# Altium project UZ_A_DAC.PrjPcb (part 2 of 3)

## Sheet Power_Neg.SchDoc
size A4; DocumentNumber: 3; SheetNumber: 3; SheetTotal: 11
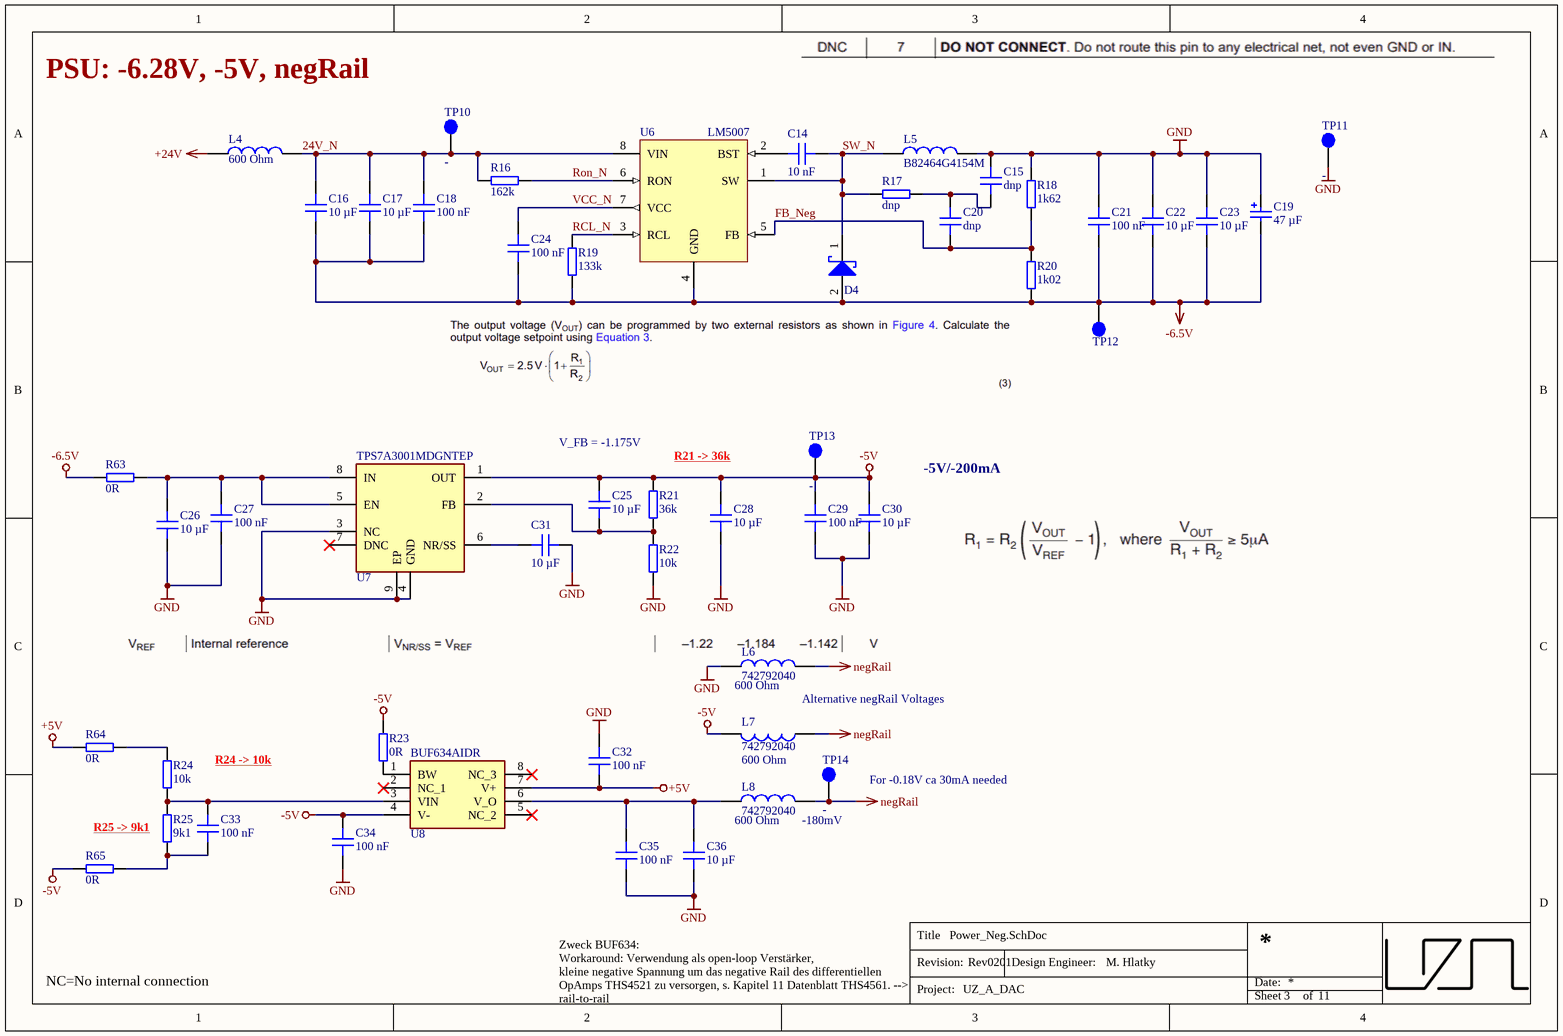
[diagram p4: Power_Neg.SchDoc]

### Parts
C14  10 nF  [C_0603]
C15  dnp  [C_1206]
C16  10 µF  [C_1206]
C17  10 µF  [C_1206]
C18  100 nF  [C_0603]
C19  47 µF  [WCAP-ASLI_5x5.5]
C20  dnp  [C_1206]
C21  100 nF  [C_0603]
C22  10 µF  [C_1206]
C23  10 µF  [C_1206]
C24  100 nF  [C_0603]
C25  10 µF  [C_1206]
C26  10 µF  [C_1206]
C27  100 nF  [C_0603]
C28  10 µF  [C_1206]
C29  100 nF  [C_0603]
C30  10 µF  [C_1206]
C31  10 µF  [C_1206]
C32  100 nF  [C_0603]
C33  100 nF  [C_0603]
C34  100 nF  [C_0603]
C35  100 nF  [C_0603]
C36  10 µF  [C_1206]
D4  BYS12-90-E3/TR3  [DIOM4227X23N]  (value not drawn)
L4  value 600 Ohm  [WE-CBF_0805_High Current]  (hidden comment: 742792040)
L5  B82464G4154M  [SMT_inductor_1050]
L6  742792040  value 600 Ohm  [WE-CBF_0805_High Current]
L7  742792040  value 600 Ohm  [WE-CBF_0805_High Current]
L8  742792040  value 600 Ohm  [WE-CBF_0805_High Current]
R16  162k  [RES 0603_1608]
R17  dnp  [RES 0603_1608]
R18  1k62  [RES 0603_1608]
R19  133k  [RES 0603_1608]
R20  1k02  [RES 0603_1608]
R21  36k  [RES 0603_1608]
R22  10k  [RES 0603_1608]
R23  0R  [RES 0603_1608]
R24  10k  [RES 0603_1608]
R25  9k1  [RES 0603_1608]
R63  0R  [RES 0603_1608]
R64  0R  [RES 0603_1608]
R65  0R  [RES 0603_1608]
TP10  -  [TP_1mm]
TP11  -  [TP_1mm]
TP12  -  [TP_1mm]  (value not drawn)
TP13  -  [TP_1mm]
TP14  -  [TP_1mm]
U6  LM5007MM/NOPB  [TSOP65P490X110-8N]  (value not drawn)
U7  TPS7A3001MDGNTEP  [SOP65P490X110-9N]
U8  BUF634AIDR  [SOIC127P600X175-8N]

### Nets
+5V: C32.1 R64.1 U8.7(V+)
+24V: L4.1
-5V: C25.2 C28.2 C29.2 C30.2 C34.2 L7.2 R21.2 R23.2 R65.1 TP13.1 U7.1(OUT) U8.4(V-)
-6.5V: C16.1 C17.1 C18.1 C19.2(N) C21.1 C22.1 C23.1 C24.1 D4.2(A) R19.1 R20.1 R63.1 TP12.1 U6.4(GND)
GND: C15.2 C19.1(P) C21.2 C22.2 C23.2 C26.1 C27.1 C28.1 C29.1 C30.1 C31.1 C32.2 C34.1 C35.1 C36.1 L5.2 L6.1 R18.2 R22.1 TP11.1 U7.3(NC) U7.4(GND) U7.9(EP)
negRail: L6.2 L7.1 L8.2 TP14.1
24V_N: C16.2 C17.2 C18.2 L4.2 R16.1 TP10.1 U6.8(VIN)
FB_Neg: C20.1 R18.1 R20.2 U6.5(FB)
RCL_N: R19.2 U6.3(RCL)
Ron_N: R16.2 U6.6(RON)
SW_N: C14.2 D4.1(K) L5.1 R17.1 U6.1(SW)
VCC_N: C24.2 U6.7(VCC)
NetC14_1: C14.1 U6.2(BST)
NetC15_1: C15.1 C20.2 R17.2
NetC25_1: C25.1 R21.1 R22.2 U7.2(FB)
NetC26_2: C26.2 C27.2 R63.2 U7.5(EN) U7.8(IN)
NetC31_2: C31.2 U7.6(NR/SS)
NetC33_1: C33.1 R25.1 R65.2
NetC33_2: C33.2 R24.1 R25.2 U8.3(VIN)
NetC35_2: C35.2 C36.2 L8.1 U8.6(V_O)
NetR23_1: R23.1 U8.1(BW)
NetR24_2: R24.2 R64.2

Not connected (* = marked no-connect by the designer): U7 7(DNC)*; U8 2(NC_1)* 5(NC_2)* 8(NC_3)*

### Notes on the sheet
- PSU: -6.28V, -5V, negRail
- V_FB = -1.175V
- R21 -> 36k
- -5V/-200mA
- Alternative negRail Voltages
- R24 -> 10k
- (near TP14) For -0.18V ca 30mA needed
- (near R25) R25 -> 9k1
- (near L8) -180mV
- NC=No internal connection
- Zweck BUF634:
  Workaround: Verwendung als open-loop Verstärker,
  kleine negative Spannung um das negative Rail des differentiellen OpAmps THS4521 zu versorgen, s. Kapitel 11 Datenblatt THS4561. --> rail-to-rail
- Title
- Revision:
- Design Engineer:
- Date:
- Project:
- Sheet
- of

### Library data of the parts
C14 = 885012206065: Capacitor 0603, 25 VDC, 10 nF, X7R; Manufacturer: Wurth Elektronik; Tolerance: 10 %; Voltage Rating: 25 VDC; Created from: MGremer; Manufacturer Part Number: 885012206065; PartID: 53; Created On: 20.12.2020 13:54:13; ComponentLink1Description: Datasheet; ComponentLink1URL: https://www.mouser.de/datasheet/2/445/885012206065-1727544.pdf; Component Type: Capacitor 0603; Device Package: 0603; Last Updated: 20.12.2020 16:43:29; Mounting Type: SMD; Operating Temperature: -55 - 125°C; Series: WCAP-CSGP; Supplier 1: Mouser; Supplier Part Number 1: 710-885012206065; Type: Capacitor; Value: 10 nF; Live Cycle Status: 1; Stock number: not stored
C15 C20 = GRM3195C1H273JA01D: Capacitor 1206, 50 VDC, 0.027 µF, C0G; Manufacturer: Murata Electronics; Tolerance: 5 %; Voltage Rating: 50 VDC; Created from: MGremer; Manufacturer Part Number: GRM3195C1H273JA01D; PartID: 51; Created On: 20.12.2020 13:54:13; ComponentLink1Description: Datasheet; ComponentLink1URL: https://www.mouser.de/datasheet/2/281/murata_03052018_GRM_Series_1-1310166.pdf; Component Type: Capacitor 1206; Device Package: 1206; Last Updated: 18.01.2021 14:28:15; Mounting Type: SMD; Operating Temperature: -55 - 125°C; Series: GRM; Supplier 1: Mouser; Supplier Part Number 1: 81-GRM315C1H273JA01D; Type: Capacitor; Value: 0.027 µF; Live Cycle Status: 1; Stock number: not stored
C16 C17 C22 C23 C25 C26 C28 C30 C31 C36 = GRT31CR61H106KE01L: Capacitor 1206, 50 VDC, 10 µF, X5R; Manufacturer: Murata Electronics; Tolerance: 10 %; Voltage Rating: 50 VDC; Created from: MGremer; Manufacturer Part Number: GRT31CR61H106KE01L; PartID: 65; Created On: 20.12.2020 13:54:13; ComponentLink1Description: Datasheet; ComponentLink1URL: https://www.mouser.de/datasheet/2/281/1/GRT31CR61H106KE01_01-1989724.pdf; Component Type: Capacitor 1206; Device Package: 1206; Last Updated: 20.12.2020 16:34:30; Mounting Type: SMD; Operating Temperature: -55 - 85°C; Series: GRT; Supplier 1: Mouser; Supplier Part Number 1: 81-GRT31CR61H106KE1L; Type: Capacitor; Value: 10 µF; Live Cycle Status: 1; Stock number: Labor SMD Container
C18 C21 C24 C27 C29 C32-C35 = C0603C104K9PACTU: Capacitor 0603, 6.3 VDC, 100 nF, X5R; Manufacturer: KEMET; Tolerance: 10 %; Voltage Rating: 6.3 VDC; Created from: MGremer; Manufacturer Part Number: C0603C104K9PACTU; PartID: 70; Created On: 20.12.2020 13:54:13; ComponentLink1Description: Datasheet; ComponentLink1URL: https://www.mouser.de/datasheet/2/212/KEM_C1006_X5R_SMD-1103249.pdf; Component Type: Capacitor 0603; Device Package: 0603; Last Updated: 20.01.2021 13:57:36; Mounting Type: SMD; Operating Temperature: -55 - 85°C; Series: SMD Comm X5R; Supplier 1: Mouser; Supplier Part Number 1: 80-C0603C104K9P; Type: Capacitor; Value: 100 nF; Live Cycle Status: 1; Stock number: not stored
C19 = 865080242004: Capacitor WCAP, 6.3 VDC, 100 µF; Manufacturer: Wuerth Elektronik; Tolerance: 20 %; Voltage Rating: 10 VDC; Created from: MHlatky; Manufacturer Part Number: 865080242004; PartID: 90; Created On: 20.12.2020 13:54:13; ComponentLink1Description: Datasheet; ComponentLink1URL: https://www.mouser.de/datasheet/2/445/865080242004-1726409.pdf; Component Type: Capacitor WCAP; Device Package: WCAP; Last Updated: 18.01.2021 16:16:48; Mounting Type: SMD; Operating Temperature: -55 - 105°C; Series: WCAP-ASLI; Supplier 1: Mouser; Supplier Part Number 1: 710-865080242004; Type: Capacitor; Value: 47 µF; Live Cycle Status: 1; Stock number: not stored
D4 = BYS12-90-E3/TR3: Schottky Rectifier, 1.5 A, 90 V; Manufacturer: Vishay General Semiconductor; Forward Voltage: 0.75 V; Forward Current: 1.5 A; Reverse Current: 100 µA; Created from: MGremer; Supplier 1: Mouser; Supplier Part Number 1: 625-BYS12-90-E3/TR3; Manufacturer Part Number: BYS12-90-E3/TR3; PartID: 2; Created On: 06.01.2021 14:34:10; ComponentLink1Description: Datasheet; ComponentLink1URL: https://www.mouser.de/datasheet/2/427/bys12_90-1768074.pdf; Component Type: Schottky Rectifier; Device Package: SMA; Last Updated: 18.01.2021 16:09:20; Mounting Type: SMD; Operating Temperature: -55 - 150 °C; Type: Schottky Rectifier; Value: -; Live Cycle Status: 1; Stock number: not stored
L4 L6-L8 = 742792040: Inductance, 0805, 100 MHz, 600 Ohm, 2 A; Manufacturer: Wurth Elektronik; Type: Inductance SMD; DC current: 2 A; Created from: MGremer; Manufacturer Part Number: 742792040; PartID: 1; Created On: 18.01.2021 14:53:17; ComponentLink1Description: Datasheet; ComponentLink1URL: https://www.mouser.de/datasheet/2/445/742792040-1720361.pdf; Component Type: Inductance; Device Package: 0805; Last Updated: 18.01.2021 14:53:25; Mounting Type: SMD; Operating Temperature: -55 - 125 °C; Series: WE-CBF; Supplier 1: Mouser; Supplier Part Number 1: 710-742792040; Live Cycle Status: 1; Stock number: not stored
L5 = B82464G4154M: Inductor SMT, 10 x 10, 150 µH, 0.8 A; Manufacturer: TDK; MF: EPCOS / TDK; Value: 150 µH; DCR: 320m; Rated Current: 0.85 A; DC current: 0.8 A; Created from: MGremer; MPN: B82464G4154M; Supplier 1: Mouser; Supplier Part Number 1: 871-B82464G4154M; Manufacturer Part Number: B82464G4154M; PartID: 5; Created On: 08.06.2021 11:33:39; ComponentLink1Description: Datasheet; ComponentLink1URL: https://www.tdk-electronics.tdk.com/inf/30/db/ind_2008/b82464g4.pdf; Component Type: Inductor; Device Package: 10.4 x 10.4 x 4.8 (mm); Last Updated: 24.08.2021 15:23:28; Mounting Type: SMD; Operating Temperature: -55 - 125 °C; Series: B82464G; Type: Inductor; Live Cycle Status: 1; Stock number: not stored
R16 = CR0603-FX-1623ELF: SMD resistor 1%; Manufacturer: Burns; Created from: MGremer; Manufacturer Part Number: CR0603-FX-1623ELF; PartID: 165; Created On: 14.12.2020 16:17:14; ComponentLink1Description: Datasheet; ComponentLink1URL: https://www.mouser.de/datasheet/2/54/crxxxxx-1858361.pdf; Component Type: SMD resistor; Device Package: 0603; Last Updated: 02.03.2021 14:07:32; Mounting Type: SMD; Supplier 1: Mouser; Supplier Part Number 1: 652-CR0603-FX1623ELF; Type: Resistor; Tolerance: 1%; Value: 162k; Live Cycle Status: 1; Stock number: not stored
R17 = -: SMD resistor E24 series; Created from: MGremer; Manufacturer Part Number: -; PartID: 147; Created On: 14.12.2020 16:17:14; ComponentLink1Description: Datasheet; ComponentLink1URL: -; Component Type: SMD resistor; Device Package: 0603; Last Updated: 02.03.2021 14:07:32; Manufacturer: -; Mounting Type: SMD; Supplier 1: -; Supplier Part Number 1: -; Type: Resistor; Tolerance: -; Value: dnp; Live Cycle Status: 1; Stock number: Labor SMD Container
R18 = ERJ-P03F1621V: SMD resistor 1%; Manufacturer: Panasonic; Created from: MGremer; Manufacturer Part Number: ERJ-P03F1621V; PartID: 191; Created On: 14.12.2020 16:17:14; ComponentLink1Description: Datasheet; ComponentLink1URL: https://www.mouser.de/datasheet/2/315/AOA0000C331-1141874.pdf; Component Type: SMD resistor; Device Package: 0603; Last Updated: 02.07.2021 11:49:34; Mounting Type: SMD; Supplier 1: Mouser; Supplier Part Number 1: 667-ERJ-P03F1621V; Type: Resistor; Tolerance: 1%; Value: 1k62; Live Cycle Status: 1; Stock number: not stored
R19 = CR0603-FX-1333ELF: SMD resistor 1%; Manufacturer: Burns; Created from: MGremer; Manufacturer Part Number: CR0603-FX-1333ELF; PartID: 166; Created On: 14.12.2020 16:17:14; ComponentLink1Description: Datasheet; ComponentLink1URL: https://www.mouser.de/datasheet/2/54/crxxxxx-1858361.pdf; Component Type: SMD resistor; Device Package: 0603; Last Updated: 02.03.2021 14:07:32; Mounting Type: SMD; Supplier 1: Mouser; Supplier Part Number 1: 652-CR0603FX-1333ELF; Type: Resistor; Tolerance: 1%; Value: 133k; Live Cycle Status: 1; Stock number: not stored
R20 = CR0603-FX-1021ELF: SMD resistor 1%; Manufacturer: Burns; Created from: MGremer; Manufacturer Part Number: CR0603-FX-1021ELF; PartID: 168; Created On: 14.12.2020 16:17:14; ComponentLink1Description: Datasheet; ComponentLink1URL: https://www.mouser.de/datasheet/2/54/crxxxxx-1858361.pdf; Component Type: SMD resistor; Device Package: 0603; Last Updated: 02.03.2021 14:07:32; Mounting Type: SMD; Supplier 1: Mouser; Supplier Part Number 1: 652-CR0603FX-1021ELF; Type: Resistor; Tolerance: 1%; Value: 1k02; Live Cycle Status: 1; Stock number: not stored
R21 = RK73H1ETTP3602F: SMD resistor 1%; Manufacturer: KOA Speer; Created from: MHoerner; Manufacturer Part Number: RK73H1ETTP3602F; PartID: 302; Created On: 07.11.2023 16:01:42; ComponentLink1Description: Datasheet; ComponentLink1URL: https://www.koaspeer.com/pdfs/RK73H.pdf; Component Type: SMD resistor; Device Package: 0603; Last Updated: 07.11.2023 16:03:21; Mounting Type: SMD; Supplier 1: Mouser; Supplier Part Number 1: 660-RK73H1ETTP3602F; Type: Resistor; Tolerance: 1%; Value: 36k; Live Cycle Status: 1; Stock number: not stored; LCSC Part Number: C114619
R22 R24 = RK73B1JTTD103J: SMD resistor E24 series; Manufacturer: KOA Speer; Tolerance: 5%; Created from: MGremer; Manufacturer Part Number: RK73B1JTTD103J; PartID: 98; Created On: 14.12.2020 16:17:14; ComponentLink1Description: Datasheet; ComponentLink1URL: https://www.mouser.de/datasheet/2/219/RK73B-1825463.pdf; Component Type: SMD resistor; Device Package: 0603; Mounting Type: SMD; Supplier 1: Mouser; Supplier Part Number 1: 660-RK73B1JTTD103J; Type: Resistor; Value: 10k; Live Cycle Status: 1; Stock number: Labor SMD Container
  R22: Last Updated: 02.03.2021 14:07:32
  R24: Last Updated: 27.05.2022 14:04:22; LCSC Part Number: C25804
R23 R63-R65 = RC0603JR-070RL: SMD resistor E24 series; Manufacturer: YAGEO; Tolerance: 5%; Created from: MGremer; Manufacturer Part Number: RC0603JR-070RL; PartID: 1; Created On: 14.12.2020 16:17:14; ComponentLink1Description: Datasheet; ComponentLink1URL: https://www.mouser.de/datasheet/2/447/PYu-RC_Group_51_RoHS_L_10-1664068.pdf; Component Type: SMD resistor; Device Package: 0603; Last Updated: 04.03.2021 09:09:42; Mounting Type: SMD; Supplier 1: Mouser; Supplier Part Number 1: 603-RC0603JR-070RL; Supplier 2: LCSC; Supplier Part Number 2: C21189; Type: Resistor; Value: 0R; Live Cycle Status: 1; Stock number: Labor SMD Container; LCSC Part Number: C21189
R25 = SG73S1JTTD9101F: SMD resistor 1%; Manufacturer: KOA Speer; Created from: MHoerner; Manufacturer Part Number: SG73S1JTTD9101F; PartID: 301; Created On: 07.11.2023 16:01:42; ComponentLink1Description: Datasheet; ComponentLink1URL: https://www.koaspeer.com/pdfs/SG73S.pdf; Component Type: SMD resistor; Device Package: 0603; Last Updated: 07.11.2023 16:06:58; Mounting Type: SMD; Supplier 1: Mouser; Supplier Part Number 1: 660-SG73S1JTTD9101F; Type: Resistor; Tolerance: 1%; Value: 9k1; Live Cycle Status: 1; Stock number: not stored; LCSC Part Number: C23260
TP10-TP14 = -: Test Point 1 mm; Value: TP; Created from: MGremer; Created: 2018_06_25_AGeiger; Manufacturer Part Number: -; PartID: 9; Created On: 02.03.2021 14:59:37; ComponentLink1Description: Datasheet; ComponentLink1URL: -; ComponentLink2Description: Homepage; ComponentLink2URL: -; Component Type: Test Point; Device Package: SMD; Last Updated: 03.11.2021 09:04:23; Manufacturer: -; Minimum Order: 1; Mounting Type: SMD; Supplier 1: -; Supplier Part Number 1: -; Type: Test point; Live Cycle Status: 1; Stock number: not stored
U6 = LM5007MM/NOPB: LM5007 75-V, 0.5-A DC/DC Buck Converter With 80-V Integrated Power MOSFET; Manufacturer: TI; MF: Texas Instruments; Created from: MHlatky; MPN: LM5007MM/NOPB; Supplier 1: Mouser; Supplier 2: Mouser; Supplier 3: Digi-Key; Supplier Part Number 1: 926-LM5007MM/NOPB; Supplier Part Number 2: 926-LM5007MM/NOPB; Supplier Part Number 3: LM5007MM/NOPBCT-ND; Package: VSSOP-8; Manufacturer Part Number: LM5007MM/NOPB; PartID: 14; Created On: 03.03.2022 16:53:36; ComponentLink1Description: Datasheet; ComponentLink1URL: https://www.ti.com/lit/ds/symlink/lm5007.pdf?ts=1616234834930&ref_url=https%253A%252F%252Fwww.google.ru%252F; Component Type: LM5007; Last Updated: 08.03.2022 11:31:47; Mounting Type: TSOP; Operating Temperature: -40 - 125; Type: Buck Converter; Live Cycle Status: 1
U7 = TPS7A3001MDGNTEP: –36V, –200mA, ULTRALOW-NOISE, NEGATIVE LINEAR REGULATOR; Manufacturer_Name: Texas Instruments; Manufacturer: TI; Created from: MHlatky; Datasheet Link: http://www.ti.com/lit/gpn/tps7a3001-ep; Height: 1.1mm; Mouser2 Part Number: 595-TPS7A3001MDGNTEP; Mouser2 Price/Stock: https://www.mouser.com/Search/Refine.aspx?Keyword=595-TPS7A3001MDGNTEP; Manufacturer_Part_Number: TPS7A3001MDGNTEP; Manufacturer Part Number: TPS7A3001MDGNTEP; PartID: 11; Created On: 03.03.2022 16:53:36; ComponentLink1Description: Datasheet; ComponentLink1URL: https://www.ti.com/lit/ds/symlink/ths4521.pdf?HQS=dis-mous-null-mousermode-dsf-pf-null-wwe&ts=1646514637932&ref_url=https%253A%252F%252Fwww.mouser.de%252F; Component Type: TPS7A3001MDGNTEP; Last Updated: 08.03.2022 11:07:28; Mounting Type: SOP; Operating Temperature: -55 - 125; Supplier 1: Mouser; Supplier Part Number 1: 595-TPS7A3001MDGNTEP; Type: Negative Line Regulator; Live Cycle Status: 1
U8 = BUF634AIDR: 36-V, 210-MHz, 250-mA Output, High-Speed Buffer; Manufacturer_Name: Texas Instruments; Manufacturer: TI; Created from: MHlatky; Datasheet Link: http://www.ti.com/lit/gpn/BUF634A; Height: 1.75mm; Mouser2 Part Number: 595-BUF634AIDR; Mouser2 Price/Stock: https://www.mouser.com/Search/Refine.aspx?Keyword=595-BUF634AIDR; Manufacturer_Part_Number: BUF634AIDR; Manufacturer Part Number: BUF634AIDR; PartID: 1; Created On: 03.03.2022 16:53:36; ComponentLink1Description: Datasheet; ComponentLink1URL: https://www.ti.com/lit/ds/symlink/buf634a.pdf?HQS=dis-mous-null-mousermode-dsf-pf-null-wwe&ts=1646325847425&ref_url=https%253A%252F%252Fwww.mouser.de%252F; Component Type: BUF634A; Last Updated: 05.03.2022 21:08:20; Mounting Type: SOIC; Operating Temperature: -40 - 125; Supplier 1: Mouser; Supplier Part Number 1: 595-BUF634AIDR; Type: OpAmp; Live Cycle Status: 1

## Sheet DAC_Reference.SchDoc
size A4; DocumentNumber: 8; SheetNumber: 8; SheetTotal: 11
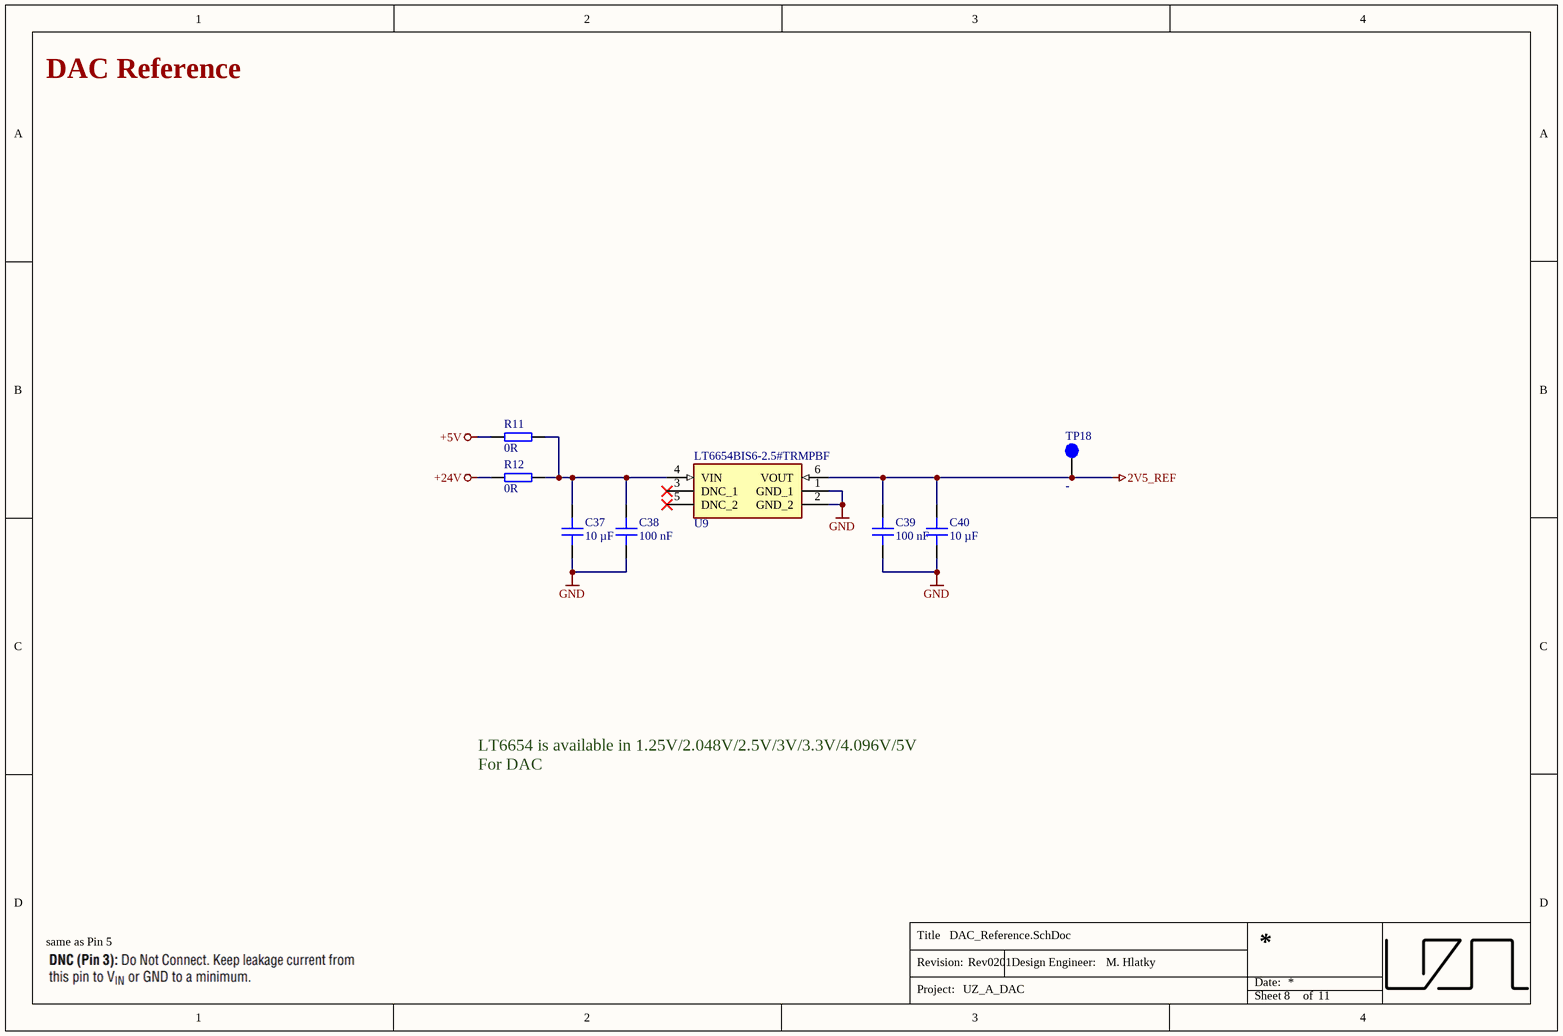
[diagram p5: DAC_Reference.SchDoc]

### Parts
C37  10 µF  [C_1206]
C38  100 nF  [C_0603]
C39  100 nF  [C_0603]
C40  10 µF  [C_1206]
R11  0R  [RES 0603_1608]
R12  0R  [RES 0603_1608]
TP18  -  [TP_1mm]
U9  LT6654BIS6-2.5#TRMPBF  [SOT95P280X100-6N]

### Nets
2V5_REF: C39.2 C40.2 TP18.1 U9.6(VOUT)
+5V: R11.1
+24V: R12.1
GND: C37.1 C38.1 C39.1 C40.1 U9.1(GND_1) U9.2(GND_2)
NetC37_2: C37.2 C38.2 R11.2 R12.2 U9.4(VIN)

Not connected (* = marked no-connect by the designer): U9 3(DNC_1)* 5(DNC_2)*

### Notes on the sheet
- DAC Reference
- LT6654 is available in 1.25V/2.048V/2.5V/3V/3.3V/4.096V/5V
  For DAC
- same as Pin 5
- Title
- Revision:
- Design Engineer:
- Date:
- Project:
- Sheet
- of

### Library data of the parts
C37 C40 = GRT31CR61H106KE01L: as C16 on sheet Power_Neg; Manufacturer Part Number: GRT31CR61H106KE01L; PartID: 65; Created On: 20.12.2020 13:54:13; ComponentLink1Description: Datasheet; ComponentLink1URL: https://www.mouser.de/datasheet/2/281/1/GRT31CR61H106KE01_01-1989724.pdf; Component Type: Capacitor 1206; Device Package: 1206; Last Updated: 20.12.2020 16:34:30; Mounting Type: SMD; Operating Temperature: -55 - 85°C; Series: GRT; Supplier 1: Mouser; Supplier Part Number 1: 81-GRT31CR61H106KE1L; Type: Capacitor; Value: 10 µF; Live Cycle Status: 1; Stock number: Labor SMD Container
C38 C39 = C0603C104K9PACTU: as C18 on sheet Power_Neg; Manufacturer Part Number: C0603C104K9PACTU; PartID: 70; Created On: 20.12.2020 13:54:13; ComponentLink1Description: Datasheet; ComponentLink1URL: https://www.mouser.de/datasheet/2/212/KEM_C1006_X5R_SMD-1103249.pdf; Component Type: Capacitor 0603; Device Package: 0603; Last Updated: 20.01.2021 13:57:36; Mounting Type: SMD; Operating Temperature: -55 - 85°C; Series: SMD Comm X5R; Supplier 1: Mouser; Supplier Part Number 1: 80-C0603C104K9P; Type: Capacitor; Value: 100 nF; Live Cycle Status: 1; Stock number: not stored
R11 R12 = RC0603JR-070RL: as R23 on sheet Power_Neg; Manufacturer Part Number: RC0603JR-070RL; PartID: 1; Created On: 14.12.2020 16:17:14; ComponentLink1Description: Datasheet; ComponentLink1URL: https://www.mouser.de/datasheet/2/447/PYu-RC_Group_51_RoHS_L_10-1664068.pdf; Component Type: SMD resistor; Device Package: 0603; Last Updated: 04.03.2021 09:09:42; Mounting Type: SMD; Supplier 1: Mouser; Supplier Part Number 1: 603-RC0603JR-070RL; Supplier 2: LCSC; Supplier Part Number 2: C21189; Type: Resistor; Value: 0R; Live Cycle Status: 1; Stock number: Labor SMD Container; LCSC Part Number: C21189
TP18 = -: as TP10 on sheet Power_Neg; Created: 2018_06_25_AGeiger; Manufacturer Part Number: -; PartID: 9; Created On: 02.03.2021 14:59:37; ComponentLink1Description: Datasheet; ComponentLink1URL: -; ComponentLink2Description: Homepage; ComponentLink2URL: -; Component Type: Test Point; Device Package: SMD; Last Updated: 03.11.2021 09:04:23; Manufacturer: -; Minimum Order: 1; Mounting Type: SMD; Supplier 1: -; Supplier Part Number 1: -; Type: Test point; Live Cycle Status: 1; Stock number: not stored
U9 = LT6654BIS6-2.5#TRMPBF: Precision Wide Supply High Output Drive Low Noise Reference; Manufacturer_Name: Analog Devices; Manufacturer_Part_Number: LT6654AHS6-5#TRMPBF; Created from: MHlatky; Datasheet Link: https://datasheet.datasheetarchive.com/originals/distributors/Datasheets_SAMA/831097393ba251ce33d430dddaea43ac.pdf; Height: 1mm; Manufacturer Part Number: LT6654BIS6-2.5#TRMPBF; PartID: 15; Created On: 03.03.2022 16:53:36; ComponentLink1Description: Datasheet; ComponentLink1URL: https://www.analog.com/media/en/technical-documentation/data-sheets/lt6654.pdf; Component Type: LT6654BIS6-2.5#TRMPBF; Last Updated: 04.04.2022 12:20:54; Manufacturer: Analog Devices; Mounting Type: SOT; Operating Temperature: -40 - 125; Supplier 1: Mouser; Supplier Part Number 1: 584-6654BIS625TRMPBF; Type: Voltage Reference; Live Cycle Status: 1

## Sheet Ethernet_Connector.SchDoc
size A4; DocumentNumber: 10; SheetNumber: 10; SheetTotal: 11
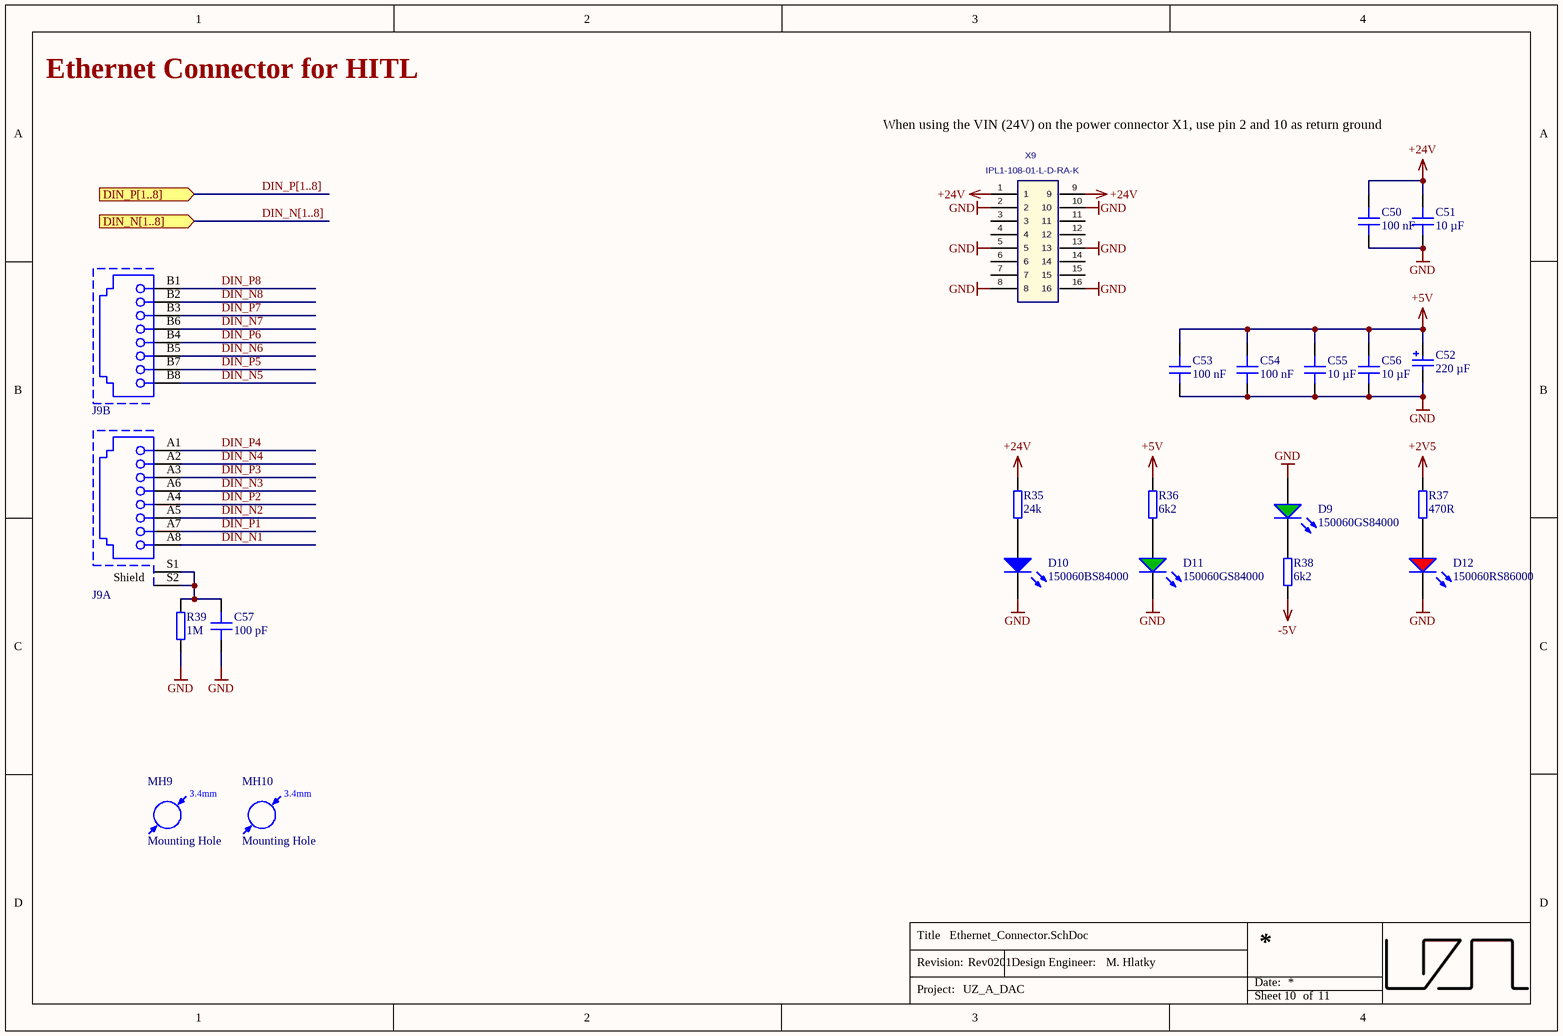
[diagram p6: Ethernet_Connector.SchDoc]

### Parts
C50  100 nF  [C_0603]
C51  10 µF  [C_1206]
C52  220 µF  [WCAP-PSHP_D8mm x L7.7mm]
C53  100 nF  [C_0603]
C54  100 nF  [C_0603]
C55  10 µF  [C_1206]
C56  10 µF  [C_1206]
C57  100 pF  [C_1206]
D9  150060GS84000  [WL-SMCW_0603]
D10  150060BS84000  [WL-SMCW_0603]
D11  150060GS84000  [WL-SMCW_0603]
D12  150060RS86000  [WL-SMCW_0603]
J9  RJHSE-5380-02  [RJHSE-5380-02]  (value not drawn)  (parts A,B of 2)
MH9  Mounting Hole  [MH_3.4]
MH10  Mounting Hole  [MH_3.4]
R35  24k  [RES 0603_1608]
R36  6k2  [RES 0603_1608]
R37  470R  [RES 0603_1608]
R38  6k2  [RES 0603_1608]
R39  1M  [RES 0603_1608]
X9  IPL1-108-01-L-D-RA-K  [IPL1-108-01-L-D-RA-K]

### Ports
DIN_N[1..8] (in), DIN_P[1..8] (in)

### Nets
+2V5: R37.2
+5V: C52.1(P) C53.2 C54.2 C55.2 C56.2 R36.2
+24V: C50.2 C51.2 R35.2 X9.1 X9.9
-5V: R38.1
GND: C50.1 C51.1 C52.2(N) C53.1 C54.1 C55.1 C56.1 C57.1 D9.2(A) D10.1(K) D11.1(K) D12.1(K) R39.1 X9.2 X9.5 X9.8 X9.10 X9.13 X9.16
DIN_N1: J9.A8
DIN_N2: J9.A5
DIN_N3: J9.A6
DIN_N4: J9.A2
DIN_N5: J9.B8
DIN_N6: J9.B5
DIN_N7: J9.B6
DIN_N8: J9.B2
DIN_P1: J9.A7
DIN_P2: J9.A4
DIN_P3: J9.A3
DIN_P4: J9.A1
DIN_P5: J9.B7
DIN_P6: J9.B4
DIN_P7: J9.B3
DIN_P8: J9.B1
NetC57_2: C57.2 J9.S1 J9.S2 R39.2
NetD9_1: D9.1(K) R38.2
NetD10_2: D10.2(A) R35.1
NetD11_2: D11.2(A) R36.1
NetD12_2: D12.2(A) R37.1

Not connected (* = marked no-connect by the designer): X9 3 4 6 7 11 12 14 15

### Buses and harness runs
bus DIN_N[1..8] = port DIN_N[1..8]
bus DIN_P[1..8] = port DIN_P[1..8]

### Notes on the sheet
- Ethernet Connector for HITL
- When using the VIN (24V) on the power connector X1, use pin 2 and 10 as return ground
- (near J9) Shield
- Title
- Revision:
- Design Engineer:
- Date:
- Project:
- Sheet
- of
- (in symbol Mounting Hole) 3.4mm

### Library data of the parts
C50 C53 C54 = C0603C104K9PACTU: as C18 on sheet Power_Neg; Manufacturer Part Number: C0603C104K9PACTU; PartID: 70; Created On: 20.12.2020 13:54:13; ComponentLink1Description: Datasheet; ComponentLink1URL: https://www.mouser.de/datasheet/2/212/KEM_C1006_X5R_SMD-1103249.pdf; Component Type: Capacitor 0603; Device Package: 0603; Last Updated: 20.01.2021 13:57:36; Mounting Type: SMD; Operating Temperature: -55 - 85°C; Series: SMD Comm X5R; Supplier 1: Mouser; Supplier Part Number 1: 80-C0603C104K9P; Type: Capacitor; Value: 100 nF; Live Cycle Status: 1; Stock number: not stored
C51 C55 C56 = GRT31CR61H106KE01L: as C16 on sheet Power_Neg; Manufacturer Part Number: GRT31CR61H106KE01L; PartID: 65; Created On: 20.12.2020 13:54:13; ComponentLink1Description: Datasheet; ComponentLink1URL: https://www.mouser.de/datasheet/2/281/1/GRT31CR61H106KE01_01-1989724.pdf; Component Type: Capacitor 1206; Device Package: 1206; Last Updated: 20.12.2020 16:34:30; Mounting Type: SMD; Operating Temperature: -55 - 85°C; Series: GRT; Supplier 1: Mouser; Supplier Part Number 1: 81-GRT31CR61H106KE1L; Type: Capacitor; Value: 10 µF; Live Cycle Status: 1; Stock number: Labor SMD Container
C52 = 875115350002: Capacitor WCAP, 16 VDC, 220 µF; Manufacturer: Wuerth Elektronik; Tolerance: 20 %; Voltage Rating: 16 VDC; Created from: MGremer; Manufacturer Part Number: 875115350002; PartID: 33; Created On: 20.12.2020 13:54:13; ComponentLink1Description: Datasheet; ComponentLink1URL: https://www.mouser.de/datasheet/2/445/875115350002-1727170.pdf; Component Type: Capacitor WCAP; Device Package: WCAP-PSHP_D8mm x L7.7mm; Last Updated: 20.12.2020 17:44:37; Mounting Type: SMD; Operating Temperature: -55 - 105°C; Series: WCAP-PSHP; Supplier 1: Mouser; Supplier Part Number 1: 710-875115350002; Type: Capacitor; Value: 220 µF; Live Cycle Status: 1; Stock number: Labor SMD Container
C57 = 885342008009: Capacitor 1206, 1 kVDC, 100 pF, C0G; Manufacturer: Wuerth Elektronik; Tolerance: 5 %; Voltage Rating: 1 kVDC; Created from: MGremer; Manufacturer Part Number: 885342008009; PartID: 62; Created On: 20.12.2020 13:54:13; ComponentLink1Description: Datasheet; ComponentLink1URL: https://www.mouser.de/datasheet/2/445/885342008009-1727900.pdf; Component Type: Capacitor 1206; Device Package: 1206; Last Updated: 20.12.2020 17:44:37; Mounting Type: SMD; Operating Temperature: -55 - 125°C; Series: WCAP-CSMH; Supplier 1: Mouser; Supplier Part Number 1: 710-885342008009; Type: Capacitor; Value: 100 pF; Live Cycle Status: 1; Stock number: Labor SMD Container
D9 D11 = 150060GS84000: WL-SMCW SMD Mono-color Chip LED Waterclear Green; Manufacturer: Wuerth Elektronik; Type: Standard; Created from: MGremer; Forward Current I_f: 20 mA; Forward Voltage U_f: 3.2 V; Wavelength: 525 nm; Light Intensity: 3000 mcd; Nominal Power: 78 mW; Manufacturer Part Number: 150060GS84000; PartID: 2; Created On: 08.12.2020 10:41:11; ComponentLink1Description: Datasheet; ComponentLink1URL: https://www.mouser.de/datasheet/2/445/150060GS75020-1714345.pdf; Component Type: LED Diode; Device Package: 0603; Last Updated: 03.03.2021 09:59:51; Mounting Type: SMD; Operating Temperature: -40 - 85 °C; Supplier 1: Mouser; Supplier Part Number 1: 710-150060GS84000; Supplier 2: Farnell; Supplier Part Number 2: 3408612; Supplier 3: Digi-Key; Supplier Part Number 3: 732-150060GS84000CT-ND; Live Cycle Status: 1; Stock number: not stored; Color: green
D10 = 150060BS84000: WL-SMCW SMD Mono-color Chip LED Waterclear Blue; Manufacturer: Wuerth Elektronik; Type: Standard; Created from: MGremer; Forward Current I_f: 20 mA; Forward Voltage U_f: 3.2 V; Wavelength: 470 nm; Light Intensity: 560 mcd; Nominal Power: 78 mW; Manufacturer Part Number: 150060BS84000; PartID: 1; Created On: 08.12.2020 10:19:38; ComponentLink1Description: Datasheet; ComponentLink1URL: https://www.mouser.de/datasheet/2/445/150060BS84000-1838909.pdf; Component Type: LED Diode; Device Package: 0603; Last Updated: 03.03.2021 09:59:51; Mounting Type: SMD; Operating Temperature: -40 - 85 °C; Supplier 1: Mouser; Supplier Part Number 1: 710-150060BS84000; Supplier 2: Farnell; Supplier Part Number 2: 3408611; Supplier 3: Digi-Key; Supplier Part Number 3: 732-150060BS84000CT-ND; Live Cycle Status: 1; Stock number: not stored; Color: blue
D12 = 150060RS86000: WL-SMCW SMD Mono-color Chip LED Waterclear Red; Manufacturer: Wuerth Elektronik; Type: Standard; Created from: MGremer; Forward Current I_f: 20 mA; Forward Voltage U_f: 2 V; Wavelength: 624 nm; Light Intensity: 800 mcd; Nominal Power: 48 mW; Manufacturer Part Number: 150060RS86000; PartID: 3; Created On: 08.12.2020 10:48:12; ComponentLink1Description: Datasheet; ComponentLink1URL: https://www.mouser.de/datasheet/2/445/150120RS75000-1714636.pdf; Component Type: LED Diode; Device Package: 0603; Last Updated: 03.03.2021 09:59:52; Mounting Type: SMD; Operating Temperature: -40 - 85 °C; Supplier 1: Mouser; Supplier Part Number 1: 710-150060RS86000; Supplier 2: Farnell; Supplier Part Number 2: 3408608; Supplier 3: Digi-Key; Supplier Part Number 3: 732-150060RS86000CT-ND; Live Cycle Status: 1; Stock number: not stored; Color: red
J9 = RJHSE-5380-02: TAB-UP, MULTIPORT, RIGHT ANGLE OR VERTICAL WITH SHIELD AND INTEGRATED LEDs; MF: Amphenol; Pin Number: 8P8C; Port: 1x2; Compliance: Lead free / RoHS; Rated Current: 1.5 A; Working Voltage: 120 VAC; Withstanding Voltage: 1000 VAC; Contact Resistance: 20 mOhm; Created from: MHlatky; ComponentLink1Description: Datasheet; ComponentLink1URL: https://www.mouser.de/datasheet/2/18/1/io_modjack_rjhse-2509079.pdf; ComponentLink2Description: Datasheet; ComponentLink2URL: https://katalog.we-online.de/em/datasheet/615016137621.pdf; MPN: RJHSE-5380-02; Published Date: July 2018; Operating Temperature: -55 - 85; Mounting Technology: THT; Packaging: Tray; Entrance: Right Angle; Supplier 1: Mouser; Supplier Part Number 1: 523-RJHSE-5380-02; Manufacturer Part Number: RJHSE-5380-02; PartID: 8; Created On: 03.03.2022 16:53:36; Component Type: RJHSE-5380-02; Last Updated: 05.03.2022 21:01:46; Manufacturer: Amphenol; Mounting Type: Board Lock; Type: Ethernet Port; Live Cycle Status: 1
MH9 MH10 = Mounting Hole: Created from: MHlatky; Manufacturer Part Number: Mounting Hole; PartID: 16; Created On: 26.01.2021 09:19:51; ComponentLink1Description: Datasheet; Component Type: Mounting Hole; Device Package: -; Last Updated: 21.03.2022 23:05:12; Manufacturer: Mounting Hole; Supplier 1: Mounting Hole; Supplier Part Number 1: Mounting Hole; Type: Mounting Hole; Value: Mounting Hole; Live Cycle Status: 1; Stock number: not stored
R35 = RK73B1JTTD243J: SMD resistor E24 series; Manufacturer: KOA Speer; Tolerance: 5%; Created from: MGremer; Manufacturer Part Number: RK73B1JTTD243J; PartID: 107; Created On: 14.12.2020 16:17:14; ComponentLink1Description: Datasheet; ComponentLink1URL: https://www.mouser.de/datasheet/2/219/RK73B-1825463.pdf; Component Type: SMD resistor; Device Package: 0603; Last Updated: 02.03.2021 14:07:32; Mounting Type: SMD; Supplier 1: Mouser; Supplier Part Number 1: 660-RK73B1JTTD243J; Type: Resistor; Value: 24k; Live Cycle Status: 1; Stock number: Labor SMD Container
R36 R38 = RK73B1JTTD622J: SMD resistor E24 series; Manufacturer: KOA Speer; Tolerance: 5%; Created from: MGremer; Manufacturer Part Number: RK73B1JTTD622J; PartID: 93; Created On: 14.12.2020 16:17:14; ComponentLink1Description: Datasheet; ComponentLink1URL: https://www.mouser.de/datasheet/2/219/RK73B-1825463.pdf; Component Type: SMD resistor; Device Package: 0603; Last Updated: 02.03.2021 14:07:32; Mounting Type: SMD; Supplier 1: Mouser; Supplier Part Number 1: 660-RK73B1JTTD622J; Type: Resistor; Value: 6k2; Live Cycle Status: 1; Stock number: Labor SMD Container
R37 = RK73B1JTTD471J: SMD resistor E24 series; Manufacturer: KOA Speer; Tolerance: 5%; Created from: MGremer; Manufacturer Part Number: RK73B1JTTD471J; PartID: 66; Created On: 14.12.2020 16:17:14; ComponentLink1Description: Datasheet; ComponentLink1URL: https://www.mouser.de/datasheet/2/219/RK73B-1825463.pdf; Component Type: SMD resistor; Device Package: 0603; Last Updated: 04.03.2021 10:03:02; Mounting Type: SMD; Supplier 1: Mouser; Supplier Part Number 1: 660-RK73B1JTTD471J; Supplier 2: LCSC; Supplier Part Number 2: C23179; Type: Resistor; Value: 470R; Live Cycle Status: 1; Stock number: Labor SMD Container; LCSC Part Number: C23179
R39 = CRCW06031M00FKEAC: SMD resistor 1%; Manufacturer: Vishay / Dale; Created from: MGremer; Manufacturer Part Number: CRCW06031M00FKEAC; PartID: 179; Created On: 14.12.2020 16:17:14; ComponentLink1Description: Datasheet; ComponentLink1URL: https://www.mouser.de/datasheet/2/427/crcwce3-1762584.pdf; Component Type: SMD resistor; Device Package: 0603; Last Updated: 02.03.2021 14:07:32; Mounting Type: SMD; Supplier 1: Mouser; Supplier Part Number 1: 71-CRCW06031M00FKEAC; Type: Resistor; Tolerance: 1%; Value: 1M; Live Cycle Status: 1; Stock number: not stored
X9 = IPL1-108-01-L-D-RA-K: 2.54 mm Double Row Termin Assembly (right angle); Manufacturer: SAMTEC; Created from: MGremer; Number of positions: 8; Manufacturer Part Number: IPL1-108-01-L-D-RA-K; PartID: 17; Created On: 30.11.2020 10:36:28; ComponentLink1Description: Homepage; ComponentLink1URL: https://www.samtec.com/products/ipl1; Component Type: Samtec Connector; Device Package: Connector; Last Updated: 15.02.2021 09:17:39; Mounting Type: THT; Supplier 1: SAMTEC; Supplier Part Number 1: IPL1-108-01-L-D-RA-K; Type: Connector; Live Cycle Status: 1; Number of rows: 2; Stock number: not stored

## Sheet FPGA Connector.SchDoc
size A4; DocumentNumber: 4; SheetNumber: 4; SheetTotal: 11
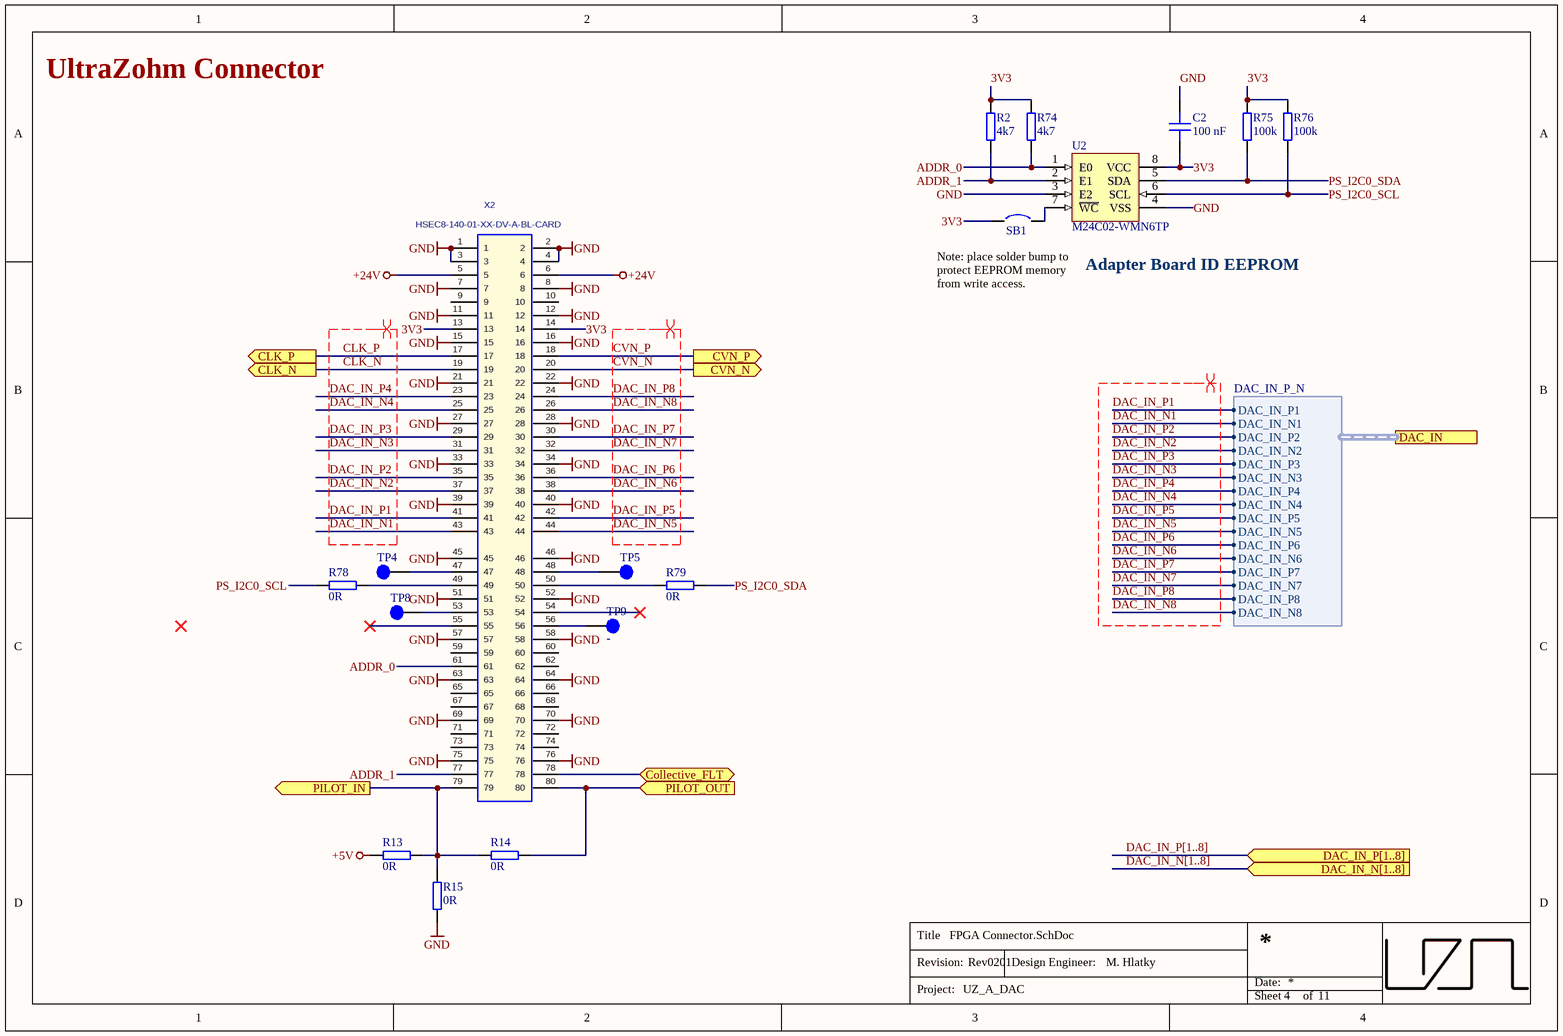
[diagram p7: FPGA Connector.SchDoc]

### Parts
C2  100 nF  [C_0603]
R2  4k7  [RES 0603_1608]
R13  0R  [RES 0603_1608]
R14  0R  [RES 0603_1608]
R15  0R  [RES 0603_1608]
R74  4k7  [RES 0603_1608]
R75  100k  [RES 0603_1608]
R76  100k  [RES 0603_1608]
R78  0R  [RES 0603_1608]
R79  0R  [RES 0603_1608]
SB1  Solder Bump 0603  [SB_0603]  (value not drawn)  (no BOM)
TP4  -  [TP_1mm]
TP5  -  [TP_1mm]
TP8  -  [TP_1mm]
TP9  -  [TP_1mm]
U2  M24C02-WMN6TP  [D0008A_N]
X2  HSEC8-140-01-XX-DV-A-BL-CARD  [HSEC8-140-01-XX-DV-A-BL-CARD]

### Ports
CLK_N (out), CLK_P (out), Collective_FLT (bidir), CVN_N (out), CVN_P (out), DAC_IN (harness DAC_IN_P_N), DAC_IN_N[1..8] (in), DAC_IN_P[1..8] (in), PILOT_IN (out), PILOT_OUT (in)

### Harnesses
DAC_IN_P_N: DAC_IN_P1, DAC_IN_N1, DAC_IN_P2, DAC_IN_N2, DAC_IN_P3, DAC_IN_N3, DAC_IN_P4, DAC_IN_N4, DAC_IN_P5, DAC_IN_N5, DAC_IN_P6, DAC_IN_N6, DAC_IN_P7, DAC_IN_N7, DAC_IN_P8, DAC_IN_N8

### Nets
+5V: R13.1
+24V: X2.5 X2.6
GND: C2.2 R15.1 U2.3(E2) U2.4(VSS) X2.1 X2.2 X2.3 X2.4 X2.7 X2.8 X2.11 X2.12 X2.15 X2.16 X2.21 X2.22 X2.27 X2.28 X2.33 X2.34 X2.39 X2.40 X2.45 X2.46 X2.51 X2.52 X2.57 X2.58 X2.63 X2.64 X2.69 X2.70 X2.75 X2.76
3V3: C2.1 R2.2 R74.2 R75.2 R76.2 SB1.1 U2.8(VCC) X2.13 X2.14
ADDR_0: R74.1 U2.1(E0) X2.61
ADDR_1: R2.1 U2.2(E1) X2.77
CLK_N: X2.19 ; port CLK_N
CLK_P: X2.17 ; port CLK_P
CVN_N: X2.20 ; port CVN_N
CVN_P: X2.18 ; port CVN_P
DAC_IN_N1: X2.43 ; port DAC_IN.DAC_IN_N1
DAC_IN_N2: X2.37 ; port DAC_IN.DAC_IN_N2
DAC_IN_N3: X2.31 ; port DAC_IN.DAC_IN_N3
DAC_IN_N4: X2.25 ; port DAC_IN.DAC_IN_N4
DAC_IN_N5: X2.44 ; port DAC_IN.DAC_IN_N5
DAC_IN_N6: X2.38 ; port DAC_IN.DAC_IN_N6
DAC_IN_N7: X2.32 ; port DAC_IN.DAC_IN_N7
DAC_IN_N8: X2.26 ; port DAC_IN.DAC_IN_N8
DAC_IN_P1: X2.41 ; port DAC_IN.DAC_IN_P1
DAC_IN_P2: X2.35 ; port DAC_IN.DAC_IN_P2
DAC_IN_P3: X2.29 ; port DAC_IN.DAC_IN_P3
DAC_IN_P4: X2.23 ; port DAC_IN.DAC_IN_P4
DAC_IN_P5: X2.42 ; port DAC_IN.DAC_IN_P5
DAC_IN_P6: X2.36 ; port DAC_IN.DAC_IN_P6
DAC_IN_P7: X2.30 ; port DAC_IN.DAC_IN_P7
DAC_IN_P8: X2.24 ; port DAC_IN.DAC_IN_P8
PS_I2C0_SCL: R76.1 R78.1 U2.6(SCL)
PS_I2C0_SDA: R75.1 R79.2 U2.5(SDA)
NetR13_2: R13.2 R14.1 R15.2 X2.79 ; port PILOT_IN
NetR14_2: R14.2 X2.80 ; port PILOT_OUT
NetR78_2: R78.2 X2.49
NetR79_1: R79.1 X2.50
NetSB1_2: SB1.2 U2.7(~{WC})
NetTP4_1: TP4.1 X2.47
NetTP5_1: TP5.1 X2.48
NetTP8_1: TP8.1 X2.53
NetTP9_1: TP9.1 X2.56
NetX2_78: X2.78 ; port Collective_FLT

Not connected (* = marked no-connect by the designer): X2 9 10 54* 55* 59 60 62 65 66 67 68 71 72 73 74

### Buses and harness runs
bus DAC_IN_N[1..8] = port DAC_IN_N[1..8]
bus DAC_IN_P[1..8] = port DAC_IN_P[1..8]

### Layout directives
differential pair: CLK_N, CLK_P, CVN_N, CVN_P, DAC_IN_N1, DAC_IN_N2, DAC_IN_N3, DAC_IN_N4, DAC_IN_N5, DAC_IN_N6, DAC_IN_N7, DAC_IN_N8, DAC_IN_P1, DAC_IN_P2, DAC_IN_P3, DAC_IN_P4, DAC_IN_P5, DAC_IN_P6, DAC_IN_P7, DAC_IN_P8

### Notes on the sheet
- UltraZohm Connector
- Note: place solder bump to protect EEPROM memory from write access.
- Adapter Board ID EEPROM
- Title
- Revision:
- Design Engineer:
- Date:
- Project:
- Sheet
- of

### Library data of the parts
C2 = C0603C104K9PACTU: as C18 on sheet Power_Neg; Manufacturer Part Number: C0603C104K9PACTU; PartID: 70; Created On: 20.12.2020 13:54:13; ComponentLink1Description: Datasheet; ComponentLink1URL: https://www.mouser.de/datasheet/2/212/KEM_C1006_X5R_SMD-1103249.pdf; Component Type: Capacitor 0603; Device Package: 0603; Last Updated: 20.01.2021 13:57:36; Mounting Type: SMD; Operating Temperature: -55 - 85°C; Series: SMD Comm X5R; Supplier 1: Mouser; Supplier Part Number 1: 80-C0603C104K9P; Type: Capacitor; Value: 100 nF; Live Cycle Status: 1; Stock number: not stored
R2 R74 = 0603WAF4701T5E: SMD resistor E24 series; Manufacturer: UNI-ROYAL; Tolerance: 1%; Created from: AGeiger; Manufacturer Part Number: 0603WAF4701T5E; PartID: 90; Created On: 14.12.2020 16:17:14; ComponentLink1Description: Datasheet; ComponentLink1URL: https://datasheet.lcsc.com/lcsc/2206010116_UNI-ROYAL-Uniroyal-Elec-0603WAF4701T5E_C23162.pdf; Component Type: SMD resistor; Device Package: 0603; Last Updated: 25.08.2022 20:03:04; Mounting Type: SMD; Supplier 1: LCSC; Supplier Part Number 1: C23162; Type: Resistor; Value: 4k7; Live Cycle Status: 1; Stock number: Labor SMD Container; LCSC Part Number: C23162
R13-R15 R78 R79 = RC0603JR-070RL: as R23 on sheet Power_Neg; Manufacturer Part Number: RC0603JR-070RL; PartID: 1; Created On: 14.12.2020 16:17:14; ComponentLink1Description: Datasheet; ComponentLink1URL: https://www.mouser.de/datasheet/2/447/PYu-RC_Group_51_RoHS_L_10-1664068.pdf; Component Type: SMD resistor; Device Package: 0603; Last Updated: 04.03.2021 09:09:42; Mounting Type: SMD; Supplier 1: Mouser; Supplier Part Number 1: 603-RC0603JR-070RL; Supplier 2: LCSC; Supplier Part Number 2: C21189; Type: Resistor; Value: 0R; Live Cycle Status: 1; Stock number: Labor SMD Container; LCSC Part Number: C21189
R75 R76 = RK73B1JTTD104J: SMD resistor E24 series; Manufacturer: KOA Speer; Tolerance: 5%; Created from: MGremer; Manufacturer Part Number: RK73B1JTTD104J; PartID: 122; Created On: 14.12.2020 16:17:14; ComponentLink1Description: Datasheet; ComponentLink1URL: https://www.mouser.de/datasheet/2/219/RK73B-1825463.pdf; Component Type: SMD resistor; Device Package: 0603; Last Updated: 27.05.2022 14:04:10; Mounting Type: SMD; Supplier 1: Mouser; Supplier Part Number 1: 660-RK73B1JTTD104J; Type: Resistor; Value: 100k; Live Cycle Status: 1; Stock number: Labor SMD Container; LCSC Part Number: C25803
SB1 = =Value: Created from: AGeiger; Revision: July-2002: Re-released for DXP Platform.; Manufacturer Part Number: Solder Bump 0603; PartID: 1; Created On: 09.01.2024 17:13:56; Component Type: Solder Bump; Device Package: 0603; Last Updated: 09.01.2024 17:13:56; Mounting Type: SMD; Value: Solder Bump 0603
TP4 TP5 TP8 TP9 = -: as TP10 on sheet Power_Neg; Created: 2018_06_25_AGeiger; Manufacturer Part Number: -; PartID: 9; Created On: 02.03.2021 14:59:37; ComponentLink1Description: Datasheet; ComponentLink1URL: -; ComponentLink2Description: Homepage; ComponentLink2URL: -; Component Type: Test Point; Device Package: SMD; Last Updated: 03.11.2021 09:04:23; Manufacturer: -; Minimum Order: 1; Mounting Type: SMD; Supplier 1: -; Supplier Part Number 1: -; Type: Test point; Live Cycle Status: 1; Stock number: not stored
U2 = M24C02-WMN6TP: 2Kbit I2C SOP-8 EEPROM ROHS; Manufacturer: STMicroelectronics; Created from: AGeiger; Manufacturer Part Number: M24C02-WMN6TP; PartID: 31; Created On: 21.11.2023 20:16:36; ComponentLink1Description: Datasheet; ComponentLink1URL: https://www.st.com/resource/en/datasheet/m24c01-w.pdf; Component Type: EEPROM; Device Package: SOIC-8; Last Updated: 21.11.2023 20:16:36; Mounting Type: SMD; Operating Temperature: -40 to +85 °C; Series: M24xxx; Supplier 1: Mouser; Supplier Part Number 1: 511-M24C02-WMN6TP; Supplier 2: LCSC; Supplier Part Number 2: C7562; Type: Memory; Value: M24C02-WMN6TP; Live Cycle Status: 1; LCSC Part Number: C7562
X2 = HSEC8-140-01-XX-DV-A-BL-CARD: Mating Card Layout for HSEC8-140-01-XX-DV-A-BL-CARD; Manufacturer: SAMTEC; Created from: MHlatky; Number of positions: 100; Created: 2018_04_23_AGeiger; Value: HSEC8-140-01-XX-DV-A-BL-CARD; Manufacturer Part Number: HSEC8-140-01-XX-DV-A-BL-CARD; PartID: 21; Created On: 26.02.2021 16:36:12; ComponentLink1Description: Homepage; ComponentLink1URL: https://www.samtec.com/products/hsec8-dp; Component Type: Board to Board Connector; Device Package: PCB Shape; Last Updated: 26.02.2021 16:37:20; Mounting Type: PCB Shape; Series: HSEC8; Supplier 1: SAMTEC; Supplier Part Number 1: NA; Type: Board to Board Connector; Live Cycle Status: 1; Stock number: not stored; Number of rows: 2

## Sheet LVDS_Receiver_Data.SchDoc
size A4; DocumentNumber: 5; SheetNumber: 5; SheetTotal: 11
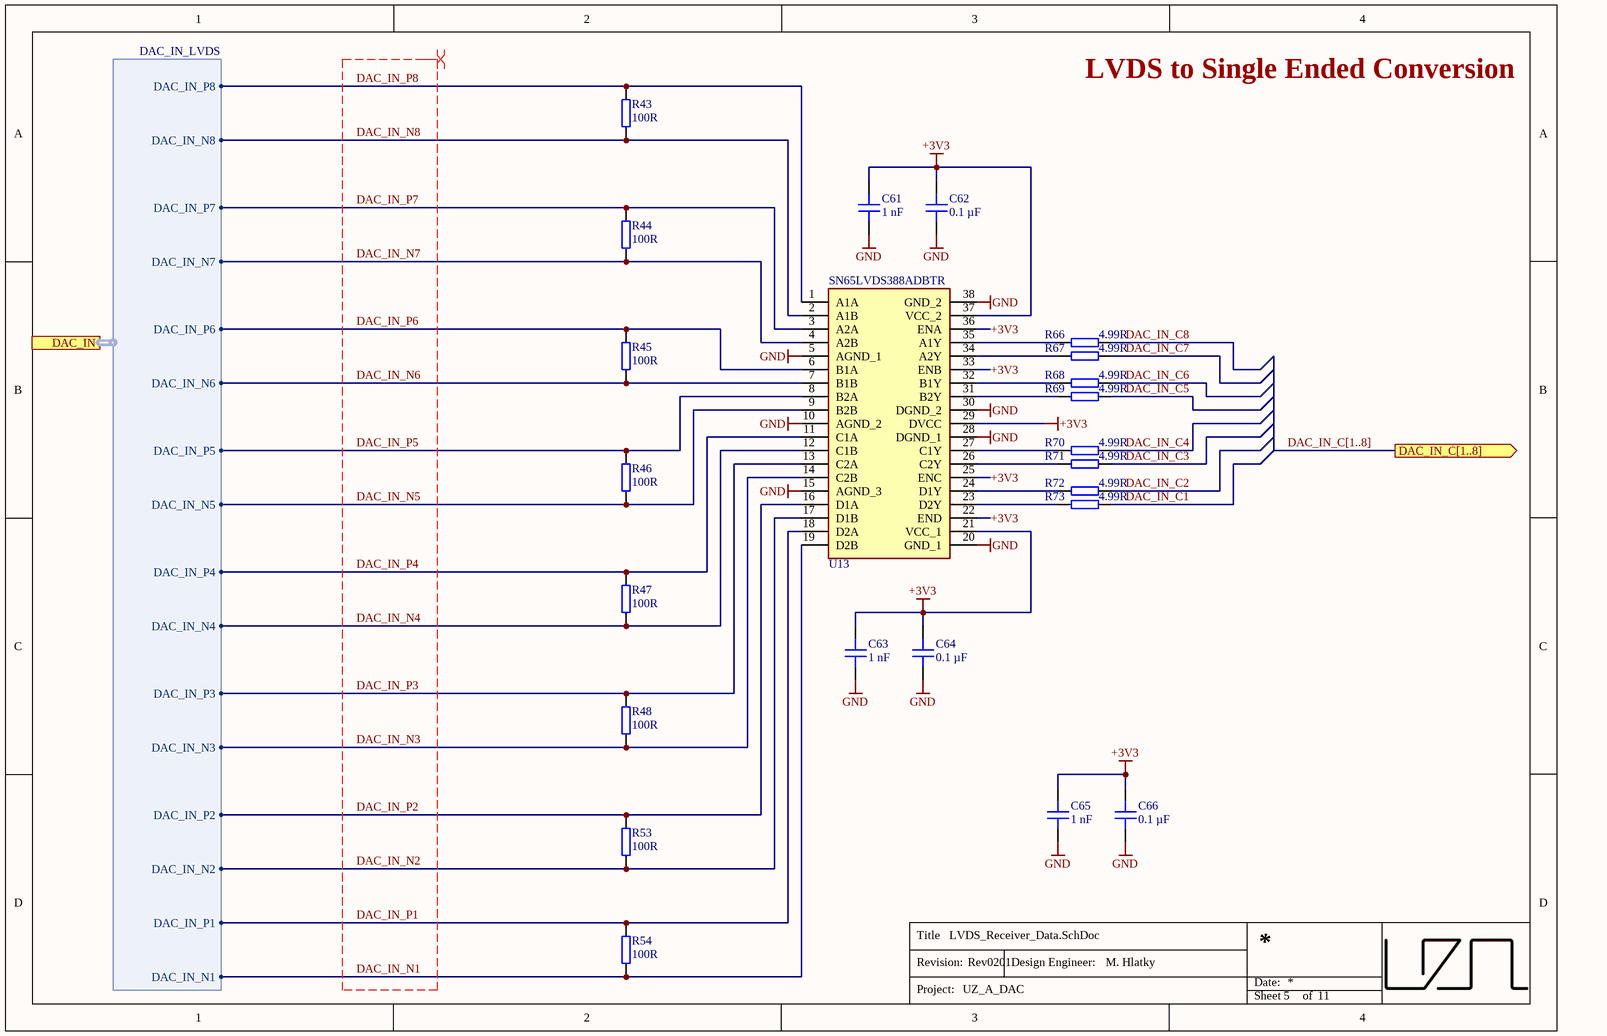
[diagram p8: LVDS_Receiver_Data.SchDoc]

### Parts
C61  1 nF  [C_1206]
C62  0.1 µF  [C_0603]
C63  1 nF  [C_1206]
C64  0.1 µF  [C_0603]
C65  1 nF  [C_1206]
C66  0.1 µF  [C_0603]
R43  100R  [RES 0603_1608]
R44  100R  [RES 0603_1608]
R45  100R  [RES 0603_1608]
R46  100R  [RES 0603_1608]
R47  100R  [RES 0603_1608]
R48  100R  [RES 0603_1608]
R53  100R  [RES 0603_1608]
R54  100R  [RES 0603_1608]
R66  4.99R  [RES 0603_1608]
R67  4.99R  [RES 0603_1608]
R68  4.99R  [RES 0603_1608]
R69  4.99R  [RES 0603_1608]
R70  4.99R  [RES 0603_1608]
R71  4.99R  [RES 0603_1608]
R72  4.99R  [RES 0603_1608]
R73  4.99R  [RES 0603_1608]
U13  SN65LVDS388ADBTR  [SOP50P640X120-38N]

### Ports
DAC_IN (harness DAC_IN_LVDS), DAC_IN_C[1..8] (out)

### Harnesses
DAC_IN_LVDS: DAC_IN_P2, DAC_IN_N2, DAC_IN_P3, DAC_IN_N3, DAC_IN_P4, DAC_IN_N4, DAC_IN_P5, DAC_IN_N5, DAC_IN_P6, DAC_IN_N6, DAC_IN_P7, DAC_IN_N7, DAC_IN_N1, DAC_IN_N8, DAC_IN_P8, DAC_IN_P1

### Nets
+3V3: C61.2 C62.1 C63.2 C64.1 C65.2 C66.1 U13.21(VCC_1) U13.22(END) U13.25(ENC) U13.29(DVCC) U13.33(ENB) U13.36(ENA) U13.37(VCC_2)
GND: C61.1 C62.2 C63.1 C64.2 C65.1 C66.2 U13.5(AGND_1) U13.10(AGND_2) U13.15(AGND_3) U13.20(GND_1) U13.28(DGND_1) U13.30(DGND_2) U13.38(GND_2)
DAC_IN_C1: R73.2  [project net D_IN]
DAC_IN_C2: R72.2  [project net D_IN]
DAC_IN_C3: R71.2  [project net D_IN]
DAC_IN_C4: R70.2  [project net D_IN]
DAC_IN_C5: R69.2  [project net D_IN]
DAC_IN_C6: R68.2  [project net D_IN]
DAC_IN_C7: R67.2  [project net D_IN]
DAC_IN_C8: R66.2  [project net D_IN]
DAC_IN_N1: R54.1 U13.19(D2B) ; port DAC_IN.DAC_IN_N1
DAC_IN_N2: R53.1 U13.17(D1B) ; port DAC_IN.DAC_IN_N2
DAC_IN_N3: R48.1 U13.14(C2B) ; port DAC_IN.DAC_IN_N3
DAC_IN_N4: R47.1 U13.12(C1B) ; port DAC_IN.DAC_IN_N4
DAC_IN_N5: R46.1 U13.9(B2B) ; port DAC_IN.DAC_IN_N5
DAC_IN_N6: R45.1 U13.7(B1B) ; port DAC_IN.DAC_IN_N6
DAC_IN_N7: R44.1 U13.4(A2B) ; port DAC_IN.DAC_IN_N7
DAC_IN_N8: R43.1 U13.2(A1B) ; port DAC_IN.DAC_IN_N8
DAC_IN_P1: R54.2 U13.18(D2A) ; port DAC_IN.DAC_IN_P1
DAC_IN_P2: R53.2 U13.16(D1A) ; port DAC_IN.DAC_IN_P2
DAC_IN_P3: R48.2 U13.13(C2A) ; port DAC_IN.DAC_IN_P3
DAC_IN_P4: R47.2 U13.11(C1A) ; port DAC_IN.DAC_IN_P4
DAC_IN_P5: R46.2 U13.8(B2A) ; port DAC_IN.DAC_IN_P5
DAC_IN_P6: R45.2 U13.6(B1A) ; port DAC_IN.DAC_IN_P6
DAC_IN_P7: R44.2 U13.3(A2A) ; port DAC_IN.DAC_IN_P7
DAC_IN_P8: R43.2 U13.1(A1A) ; port DAC_IN.DAC_IN_P8
NetR66_1: R66.1 U13.35(A1Y)
NetR67_1: R67.1 U13.34(A2Y)
NetR68_1: R68.1 U13.32(B1Y)
NetR69_1: R69.1 U13.31(B2Y)
NetR70_1: R70.1 U13.27(C1Y)
NetR71_1: R71.1 U13.26(C2Y)
NetR72_1: R72.1 U13.24(D1Y)
NetR73_1: R73.1 U13.23(D2Y)

### Buses and harness runs
bus DAC_IN_C[1..8] = port DAC_IN_C[1..8]

### Layout directives
differential pair: DAC_IN_N1, DAC_IN_N2, DAC_IN_N3, DAC_IN_N4, DAC_IN_N5, DAC_IN_N6, DAC_IN_N7, DAC_IN_N8, DAC_IN_P1, DAC_IN_P2, DAC_IN_P3, DAC_IN_P4, DAC_IN_P5, DAC_IN_P6, DAC_IN_P7, DAC_IN_P8

### Notes on the sheet
- LVDS to Single Ended Conversion
- Title
- Revision:
- Design Engineer:
- Date:
- Project:
- Sheet
- of

### Library data of the parts
C61 C63 C65 = 12065C102KAT2A: Capacitor 1206, 50 VDC, 1 nF, X7R; Manufacturer: AVX; Tolerance: 10%; Voltage Rating: 50 VDC; Created from: MGremer; Manufacturer Part Number: 12065C102KAT2A; PartID: 73; Created On: 20.12.2020 13:54:13; ComponentLink1Description: Datasheet; ComponentLink1URL: https://www.mouser.de/datasheet/2/40/X7RDielectric-777024.pdf; Component Type: Capacitor 1206; Device Package: 1206; Last Updated: 18.01.2021 14:28:15; Mounting Type: SMD; Operating Temperature: -55 - 125°C; Series: MLCC X7R; Supplier 1: Mouser; Supplier Part Number 1: 581-12065C102K; Type: Capacitor; Value: 1 nF; Live Cycle Status: 1; Stock number: not stored
C62 C64 C66 = C0603X104K5RAC7411: Capacitor 0603, 50 VDC, 0.1 µF, X7R; Manufacturer: KEMET; Tolerance: 10 %; Voltage Rating: 50 VDC; Created from: MGremer; Manufacturer Part Number: C0603X104K5RAC7411; PartID: 3; Created On: 20.12.2020 13:54:13; ComponentLink1Description: Datasheet; ComponentLink1URL: https://www.mouser.de/datasheet/2/212/1/KEM_C1013_X7R_FT_CAP_SMD-1103280.pdf; Component Type: Capacitor 0603; Device Package: 0603; Last Updated: 04.03.2021 09:24:28; Mounting Type: SMD; Operating Temperature: -55 - 125°C; Series: SMD Comm X7R Flex; Supplier 1: Mouser; Supplier Part Number 1: 80-C0603X104K5R7411; Supplier 2: LCSC; Supplier Part Number 2: C14663; Type: Capacitor; Value: 0.1 µF; Live Cycle Status: 1; LCSC Part Number: C14663; Stock number: Labor SMD Container
R43-R48 R53 R54 = AC0603FR-13100RL: SMD resistor 1%; Manufacturer: Yageo; Created from: MGremer; Manufacturer Part Number: AC0603FR-13100RL; PartID: 161; Created On: 14.12.2020 16:17:14; ComponentLink1Description: Datasheet; ComponentLink1URL: https://www.mouser.de/datasheet/2/447/PYu-AC_51_RoHS_L_7-1714230.pdf; Component Type: SMD resistor; Device Package: 0603; Last Updated: 02.03.2021 14:07:32; Mounting Type: SMD; Supplier 1: Mouser; Supplier Part Number 1: 603-AC0603FR-13100RL; Type: Resistor; Tolerance: 1%; Value: 100R; Live Cycle Status: 1; Stock number: not stored
R66-R73 = CRCW06034R99FKEA: SMD resistor 1%; Manufacturer: Vishay / Dale; Created from: MGremer; Manufacturer Part Number: CRCW06034R99FKEA; PartID: 178; Created On: 14.12.2020 16:17:14; ComponentLink1Description: Datasheet; ComponentLink1URL: https://www.mouser.de/datasheet/2/427/dcrcwe3-1762152.pdf; Component Type: SMD resistor; Device Package: 0603; Last Updated: 02.03.2021 14:07:32; Mounting Type: SMD; Supplier 1: Mouser; Supplier Part Number 1: 71-CRCW0603-4.99-E3; Type: Resistor; Tolerance: 1%; Value: 4.99R; Live Cycle Status: 1; Stock number: not stored
U13 = SN65LVDS388ADBTR: High-Speed Differential Line Receivers; Manufacturer_Name: Texas Instruments; Manufacturer: TI; Created from: MHlatky; Datasheet Link: http://www.ti.com/lit/gpn/SN65LVDS388A; Height: 1.2mm; Manufacturer_Part_Number: SN65LVDS388ADBTR; Manufacturer Part Number: SN65LVDS388ADBTR; PartID: 9; Created On: 03.03.2022 16:53:36; ComponentLink1Description: Datasheet; ComponentLink1URL: https://www.ti.com/lit/ds/symlink/sn65lvds388a.pdf?HQS=dis-mous-null-mousermode-dsf-pf-null-wwe&ts=1646514254859&ref_url=https%253A%252F%252Fwww.mouser.de%252F; Component Type: SN65LVDS388ADBTR; Last Updated: 08.03.2022 12:13:05; Mounting Type: SOP; Operating Temperature: -40 - 85; Supplier 1: Mouser; Supplier Part Number 1: 595-SN65LVDS388ADBTR; Type: LVDS Interface; Live Cycle Status: 1